# EAGLE design roomba_wall_v2 (EAGLE 7.6.0)
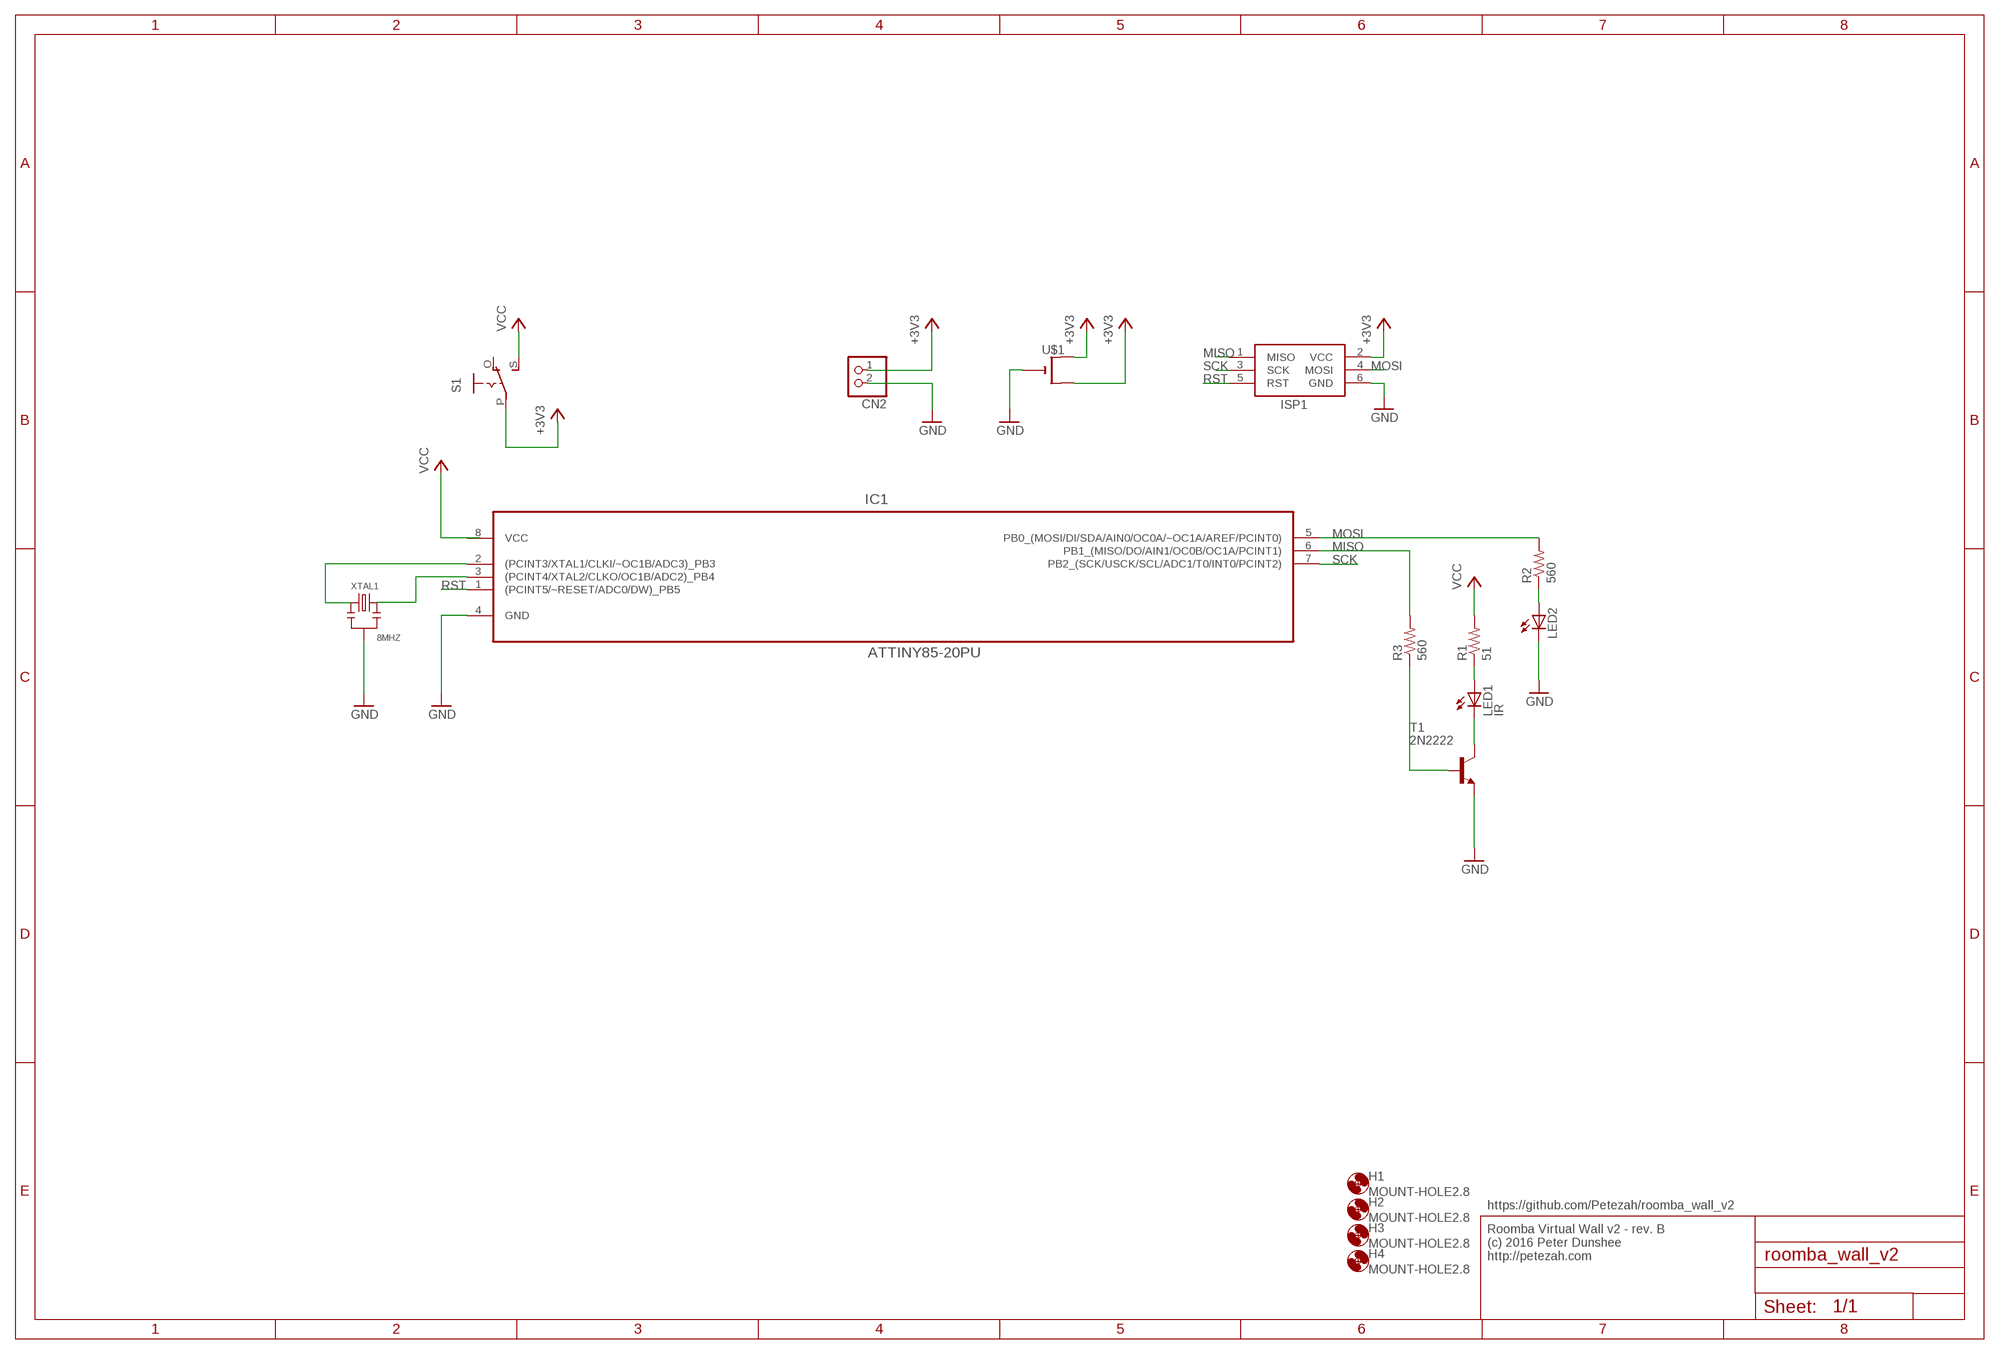
[diagram p0: schematic, sheet 1]

## Parts
CN2  JST_2PIN-SMT-RA  [JST-PH-2-SMT-RA]
H1  MOUNT-HOLE2.8  [2,8]
H2  MOUNT-HOLE2.8  [2,8]
H3  MOUNT-HOLE2.8  [2,8]
H4  MOUNT-HOLE2.8  [2,8]
IC1  ATTINY85-20PU  [DIP254P762X533-8]
ISP1  AVRISP-6  [AVRISP]
LED1  IR  LED3MM  [LED3MM]
LED2  LED3MM  [LED3MM]
R1  51  R-US_0204/7  [0204/7]
R2  560  R-US_0204/7  [0204/7]
R3  560  R-US_0204/7  [0204/7]
S1  EG1218S  [EG1218]
T1  2N2222  [TO92-EBC-OVAL]
U$1  CR2032THM  [CR2032-THRU]
XTAL1  8MHZ  DIP-CERAMIC-RESONATOR/-OSCILLATOR-8MHZ(3P-2.5-8X3MM)  [X3-2.5-8X3X5.5MM]

## Nets
+3V3: CN2.1 ISP1.2(VCC) S1.P U$1.+1(+) U$1.+2(+1)
GND: CN2.2 IC1.4(GND) ISP1.6(GND) LED2.K(C) T1.E U$1.- XTAL1.2
MISO: IC1.6(PB1_(MISO/DO/AIN1/OC0B/OC1A/PCINT1)) ISP1.1(MISO) R3.2
MOSI: IC1.5(PB0_(MOSI/DI/SDA/AIN0/OC0A/~OC1A/AREF/PCINT0)) ISP1.4(MOSI) R2.2
N$1: IC1.2((PCINT3/XTAL1/CLKI/~OC1B/ADC3)_PB3) XTAL1.1
N$2: IC1.3((PCINT4/XTAL2/CLKO/OC1B/ADC2)_PB4) XTAL1.3
N$3: LED1.A R1.1
N$4: LED1.K(C) T1.C
N$5: R3.1 T1.B
N$6: LED2.A R2.1
RST: IC1.1((PCINT5/~RESET/ADC0/DW)_PB5) ISP1.5(RST)
SCK: IC1.7(PB2_(SCK/USCK/SCL/ADC1/T0/INT0/PCINT2)) ISP1.3(SCK)
VCC: R1.2 S1.S
Unconnected: S1.O

## Notes on the sheet
- https://github.com/Petezah/roomba_wall_v2
- Roomba Virtual Wall v2 - rev. B
  (c) 2016 Peter Dunshee
  http://petezah.com

## Power pins joined to a net without a drawn wire
VCC: IC1.8(VCC)

## Library data of the parts
CN2 = adafruit:JST_2PIN: JST 2-Pin Connectors of various flavors SMT-RA (S2B-PH-SM4) 4UConnector #17311 SMT (B2B-PH-SM4) THM-RA (S2B-PH) THM (B2B-PH)
H1-H4 = holes:MOUNT-HOLE: MOUNTING HOLE with drill center marker
IC1 = Atmel_By_element14_Batch_1-00:ATTINY85-20PU: 8-bit Microcontroller with In-System Programmable Flash; MPN: ATTINY85-20PU; OC_FARNELL: 1455162; OC_NEWARK: 58M3796; PACKAGE: PDIP-8; SUPPLIER: Atmel
ISP1 = adafruit:AVRISP: AVR ISP HEADER Standard 6 pin header for AVR programming
LED1 LED2 = adafruit:LED: LED OSRAM: - CHIPLED LG R971, LG N971, LY N971, LG Q971, LY Q971, LO R971, LY R971 LH N974, LH R974 LS Q976, LO Q976, LY Q976 LO Q996 - Hyper CHIPLED LW Q18S LB Q993, LB Q99A, LB R99A - SideLED LS A670, LO A670, LY A670, LG A670, LP A670 LB A673, LV A673, LT A673, LW A673 LH A674 LY A675 LS A676, LA A676, LO A676, LY A676, LW A676 LS A679, LY A679, LG A679 - Hyper Micro SIDELED® LS Y876, LA Y876, LO Y876, LY Y876 LT Y87S - SmartLED LW L88C, LW L88S LB L89C, LB L89S, LG L890 LS L89K, LO L89K, LY L89K LS L896, LA L896, LO L896, LY L896 - TOPLED LS T670, LO T670, LY T670, LG T670, LP T670 LSG T670, LSP T670, LSY T670, LOP T670, LYG T670 LG T671, LOG T671, LSG T671 LB T673, LV T673, LT T673, LW T673 LH T674 LS T676, LA T676, LO T676, LY T676, LB T676, LH T676, LSB T676, LW T676 LB T67C, LV T67C, LT T67C, LS T67K, LO T67K, LY T67K, LW E67C LS E67B, LA E67B, LO E67B, LY E67B, LB E67C, LV E67C, LT E67C LW T67C LS T679, LY T679, LG T679 LS T770, LO T770, LY T770, LG T770, LP T770 LB T773, LV T773, LT T773, LW T773 LH T774 LS E675, LA E675, LY E675, LS T675 LS T776, LA T776, LO T776, LY T776, LB T776 LHGB T686 LT T68C, LB T68C - Hyper Mini TOPLED® LB M676 - Mini TOPLED Santana® LG M470 LS M47K, LO M47K, LY M47K Source: http://www.osram.convergy.de/
R1-R3 = adafruit:R-US_: RESISTOR, American symbol
S1 = adafruit:EG1218: SLIDING SWITCH 0.1" spacing through hole, vertical SPDT slide switch http://www.ladyada.net/library/pcb/eaglelibrary.html
T1 = adafruit:2N2222: NPN TRANSISTOR Big oval pads
U$1 = adafruit:CR2032
XTAL1 = Seeed-OPL-Crystal-Oscillator:DIP-CERAMIC-RESONATOR/-OSCILLATOR-8MHZ(3P-2.5-8X3MM): 306030010; MPN: CSTLS8M00G53Z-A0

## Board
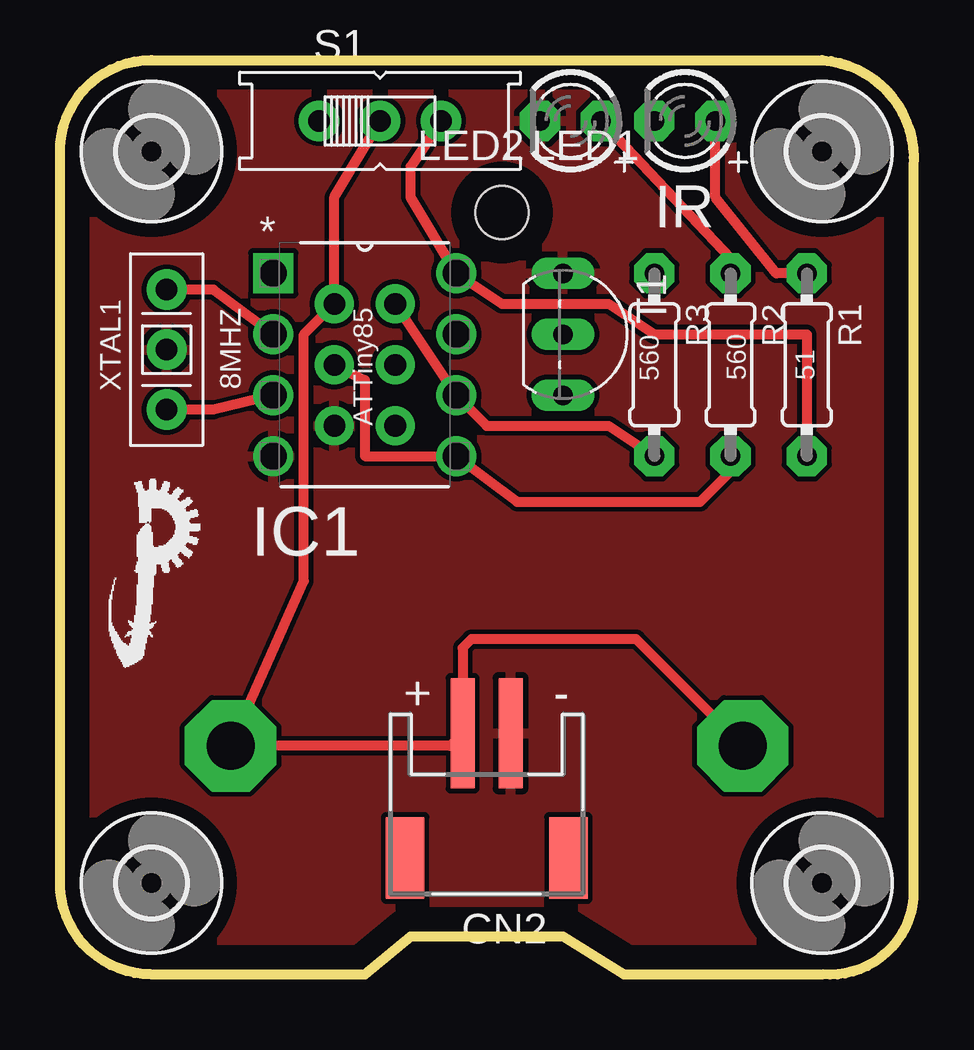
[diagram p1: board, top side]
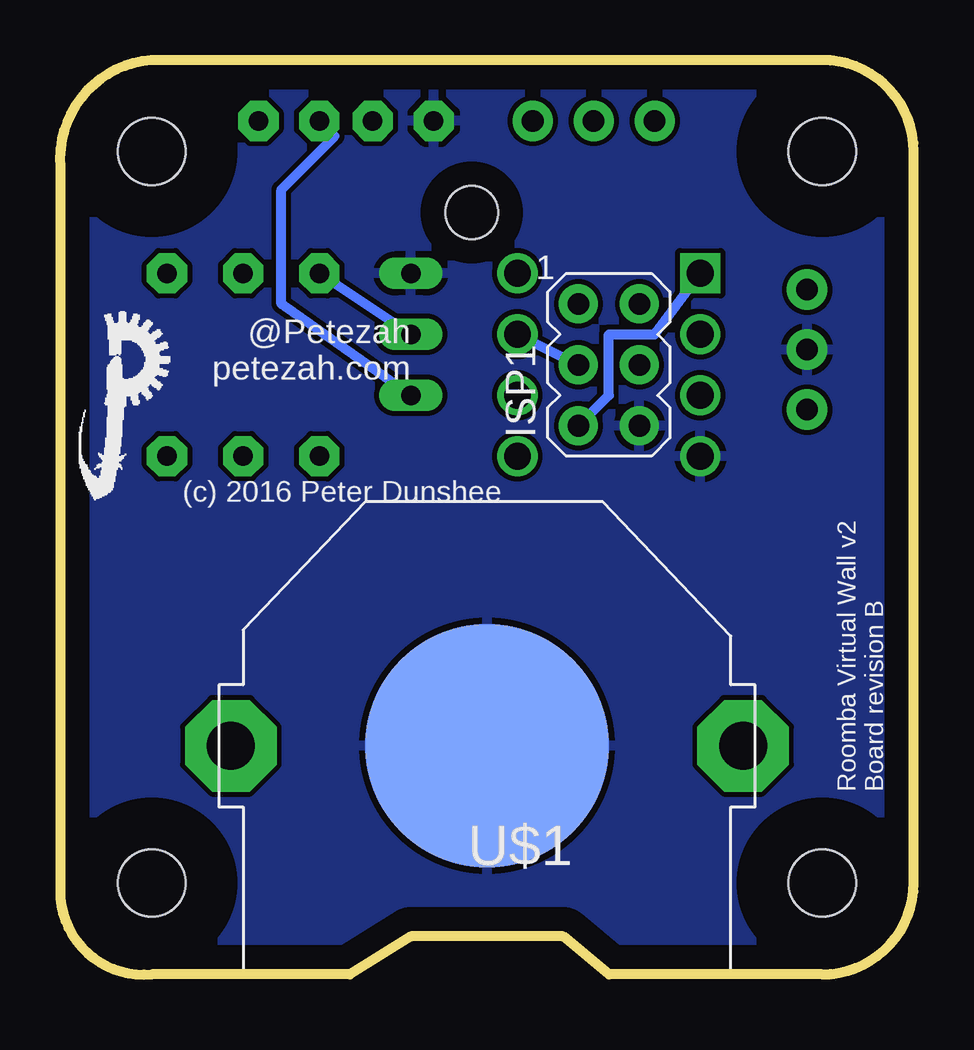
[diagram p2: board, bottom side, seen from below]

Size 35.57 x 38.11 mm. Coordinates in mm from the lower left corner, seen from the top.
Outline: 3.81,0.01 12.7,0.01 14.61,1.6 20.96,1.6 23.5,0.01 31.75,0.01 arc90 35.56,3.19 35.56,33.67 arc90 31.75,38.11 3.81,38.11 arc90 0,34.3 0,3.82 arc90 3.81,0.01
Copper layers (1*16): Top 0.035mm / dielectric 1.5mm / Bottom 0.035mm
Design rules "default": minimum track width 10mil, minimum drill 24mil, track to track 8mil, track to pad 8mil, pad to pad 8mil, via to via 8mil, smd to smd 8mil, copper to edge 40mil, drill to drill 8mil, minimum pad ring 10mil, minimum via ring 8mil, stop-mask expansion 4mil, vias tented up to drill 0mil, thermal gap 10mil
Holes 2.2 mm at 18.41,31.76

### Footprints (pad centres in the part's own frame; a part is rotated, then mirrored left to right if it is on the bottom)
JST-PH-2-SMT-RA = smd 1 x 4.6: 1 1,-3.7; 2 -1,-3.7 | smd 1.6 x 3.4: NC1 -3.4,1.5; NC2 3.4,1.5
2,8 = hole 2.8: 0,0
DIP254P762X533-8 = drill 1.118 square: 1 -7.62,7.62 | drill 1.118: 2 -7.62,5.08; 3 -7.62,2.54; 4 -7.62,0; 5 0,0; 6 0,2.54; 7 0,5.08; 8 0,7.62
AVRISP = drill 0.9 pad 1.626: 1 -1.27,2.54; 2 1.27,2.54; 3 -1.27,0; 4 1.27,0; 5 -1.27,-2.54; 6 1.27,-2.54
LED3MM = drill 0.813 pad 1.676 octagon: A -1.27,0; K 1.27,0
0204/7 = drill 0.813 pad 1.676 octagon: 1 -3.81,0; 2 3.81,0
EG1218 = drill 0.9 pad 1.676: O -2.54,0; P 0,0; S 2.54,0
TO92-EBC-OVAL = drill 0.813 long: B 0,-1.27; C 2.54,-1.27; E -2.54,-1.27
CR2032-THRU = drill 2 pad 3.81 octagon: +1 -10.668,0; +2 10.668,0 | smd 10.16 x 10.16: - 0,0
X3-2.5-8X3X5.5MM = drill 0.9 pad 1.676: 1 2.5,0; 2 0,0; 3 -2.5,0

### Placement (x,y rotation side)
CN2  17.78,6.36 180 top
H1  31.75,3.82 0 top
H2  3.81,3.82 0 top
H3  31.75,34.3 0 top
H4  3.81,34.3 0 top
IC1  16.51,21.6 0 top
ISP1  12.7,25.41 0 bottom
LED1  26.04,35.57 180 top
LED2  21.27,35.57 180 top
R1  31.12,25.41 270 top
R2  27.94,25.41 270 top
R3  24.77,25.41 270 top
S1  13.34,35.57 0 top
T1  22.23,26.68 270 top
U$1  17.78,9.54 180 bottom
U$2  [LOGO_TINY]  1.91,12.71 0 top
U$3  [LOGO_TINY]  34.92,19.7 0 bottom
XTAL1  4.45,26.05 90 top

### Tracks (layer width: path | path; a pad name or v marks a point on that pad's centre or on a via)
+3V3
  Top 0.406: U$1.+2 24,13.98 17.14,13.98 16.78,13.62 CN2.1 16.26,9.54 U$1.+1 10.16,16.4 10.16,26.68 ISP1.2 11.43,32.4 S1.P
GND
  pour Bottom: 0,38.11 35.56,38.11 35.56,0.01 23.5,0.01 20.96,1.6 14.61,1.6 12.7,0.01 0,0.01
  pour Top: 0,38.11 35.56,38.11 35.56,0.01 23.5,0.01 20.96,1.6 14.61,1.6 12.7,0.01 0,0.01 0,4.46
MISO
  Top 0.406: ISP1.1 IC1.6 17.78,22.87 22.86,22.87 R3.2
MOSI
  Top 0.406: R2.2 27.94,20.97 26.67,19.7 19.05,19.7 IC1.5 12.7,21.6 12.7,24.78 ISP1.4
N$1
  Top 0.406: IC1.2 6.39,28.55 XTAL1.1
N$2
  Top 0.406: IC1.3 6.39,23.55 XTAL1.3
N$3
  Top 0.406: R1.1 29.84,29.22 27.3,32.4 LED1.A
N$4
  Bottom 0.406: T1.C 26.35,27.95 26.35,32.72 24.13,34.94 LED1.K
N$5
  Bottom 0.406: T1.B R3.1
N$6
  Top 0.406: LED2.A 27.94,29.86 R2.1
RST
  Bottom 0.406: ISP1.5 12.7,24.14 12.7,26.68 10.79,26.68 IC1.1
SCK
  Bottom 0.406: IC1.7 ISP1.3
VCC
  Top 0.406: R1.2 31.12,26.68 24.77,26.68 22.86,27.95 18.41,27.95 IC1.8 14.61,32.4 14.61,33.67 S1.S

### Text on the board
tPlace: IR | 560 | 560 | 51 | ATTiny85
bPlace: @Petezah / petezah.com | (c) 2016 Peter Dunshee | Roomba Virtual Wall v2 / Board revision B